# Altium project BTL_IOT.PrjPcb
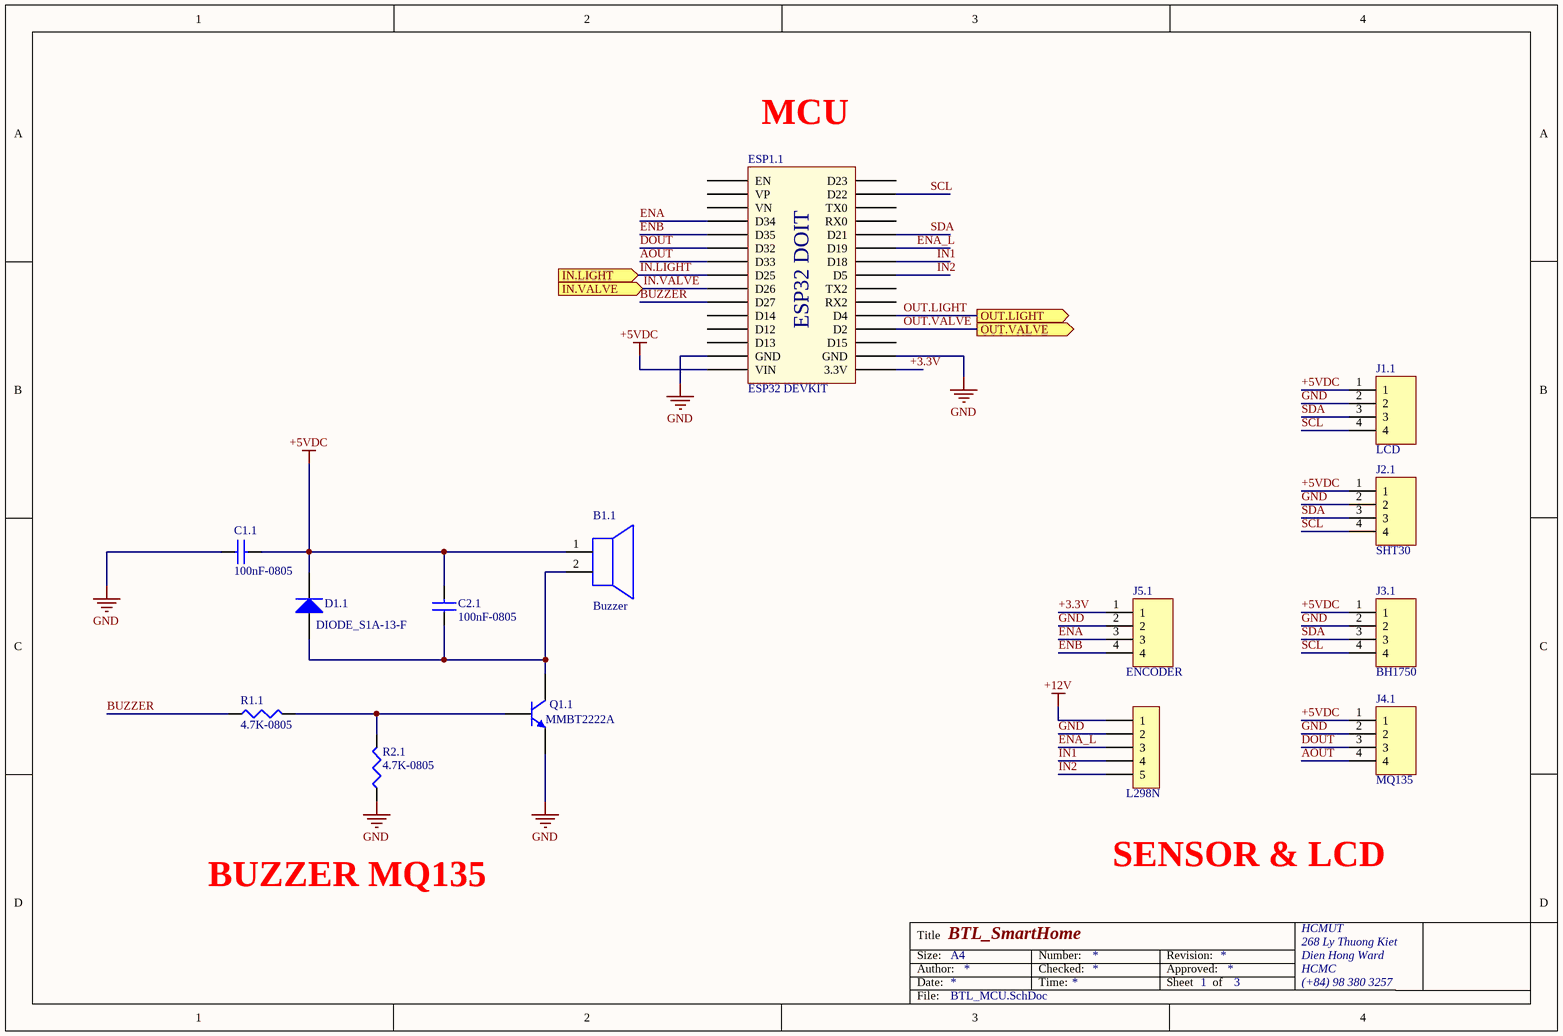
[diagram p0: BTL_MCU.SchDoc]
3 sheets, 54 parts. Net scope: flat (ports and power ports of the same name join across sheets).
Board file: BTL_IOT.PcbDoc
Sheets:
  BTL_MCU.SchDoc
  BTL_POWER.SchDoc
  BTL_RELAY.SchDoc

## Sheet BTL_MCU.SchDoc: BTL_SmartHome
size A4; Organization: HCMUT; Address1: 268 Ly Thuong Kiet; Address2: Dien Hong Ward; Address3: HCMC; Address4: (+84) 98 380 3257; SheetNumber: 1; SheetTotal: 3

### Parts
B1.1  Buzzer  [Buzzer]
C1.1  100nF-0805  [CAP0805]
C2.1  100nF-0805  [CAP0805]
D1.1  DIODE_S1A-13-F  [DO-214AC]
ESP1.1  ESP32 DEVKIT  [ESP32 WROOM 32 KIT]
H1.1  L298N  [XH2.54M-5]
J1.1  LCD  [CON4_78_B4B-PH-K-S(LF)(SN)]
J2.1  SHT30  [CON4_78_B4B-PH-K-S(LF)(SN)]
J3.1  BH1750  [CON4_78_B4B-PH-K-S(LF)(SN)]
J4.1  MQ135  [CON4_78_B4B-PH-K-S(LF)(SN)]
J5.1  ENCODER  [CON4_78_B4B-PH-K-S(LF)(SN)]
Q1.1  MMBT2222A  [SOT23-3]
R1.1  4.7K-0805  [RES0805]
R2.1  4.7K-0805  [RES0805]

### Ports
IN.LIGHT (in), IN.VALVE (in), OUT.LIGHT (out), OUT.VALVE (out)

### Nets
+5VDC: B1.1.1(+) C1.1.2 C2.1.2 D1.1.2(K) ESP1.1.15(VIN) J1.1.1 J2.1.1 J3.1.1 J4.1.1
+12V: H1.1.1
GND: C1.1.1 ESP1.1.14(GND) ESP1.1.17(GND) H1.1.2 J1.1.2 J2.1.2 J3.1.2 J4.1.2 J5.1.2 Q1.1.2(E) R2.1.1
+3.3V: ESP1.1.16(3.3V) J5.1.1
AOUT: ESP1.1.7(D33) J4.1.4
BUZZER: ESP1.1.10(D27) R1.1.1
DOUT: ESP1.1.6(D32) J4.1.3
ENA: ESP1.1.4(D34) J5.1.3
ENA_L: ESP1.1.25(D19) H1.1.3
ENB: ESP1.1.5(D35) J5.1.4
IN1: ESP1.1.24(D18) H1.1.4
IN2: ESP1.1.23(D5) H1.1.5
IN.LIGHT: ESP1.1.8(D25) ; port IN.LIGHT
IN.VALVE: ESP1.1.9(D26) ; port IN.VALVE
OUT.LIGHT: ESP1.1.20(D4) ; port OUT.LIGHT
OUT.VALVE: ESP1.1.19(D2) ; port OUT.VALVE
SCL: ESP1.1.29(D22) J1.1.4 J2.1.4 J3.1.4
SDA: ESP1.1.26(D21) J1.1.3 J2.1.3 J3.1.3
NetB1.1_2: B1.1.2(-) C2.1.1 D1.1.1(A) Q1.1.3(C)
NetQ1.1_1: Q1.1.1(B) R1.1.2 R2.1.2

Not connected (* = marked no-connect by the designer): ESP1.1 1(EN) 2(VP) 3(VN) 11(D14) 12(D12) 13(D13) 18(D15) 21(RX2) 22(TX2) 27(RX0) 28(TX0) 30(D23)

### Notes on the sheet
- (near ESP1.1) MCU
- BUZZER MQ135
- SENSOR & LCD
- Title
- Size:
- Date:
- Author:
- A4
- Number:
- Time:
- Checked:
- Revision:
- Sheet
- Approved:
- of
- File:
- (in symbol ESP32 WROOM 32 KIT) ESP32 DOIT

### Library data of the parts
C1.1 C2.1 = CC0805JRNPO9BN300: CAP CER 30PF 50V NPO 0805; Manufacturer: Yageo; Tolerance: ±5%; Temperature Coefficient: C0G, NP0; Notification: Current market demand for these product types have resulted in fluctuating and extending lead times. Lead times may differ.; Supplier 1: Digi-Key; Manufacturer Part Number: CC0805JRNPO9BN300; RoHS: RoHS Compliant; Category: Capacitors; Stock 1: 0; Pricing 1: 1=0.15, 10=0.107, 100=0.0503, 500=0.03524, 1000=0.02918 (USD); Packaging: Cut Tape (CT); Part Status: Active; Voltage - Rated: 50V; Operating Temperature: -55°C ~ 125°C; Features: High Voltage; Ratings: -; Applications: General Purpose; Failure Rate: -; Mounting Type: Surface Mount, MLCC; Package / Case: 0805 (2012 Metric); Size / Dimension: 0.079" L x 0.049" W (2.00mm x 1.25mm); Height - Seated (Max): -; Thickness (Max): 0.028" (0.70mm); Lead Spacing: -; Lead Style: -; ComponentLink1URL: http://www.yageo.com/documents/recent/UPY-GP_NP0_16V-to-50V_16.pdf; ComponentLink1Description: http://www.yageo.com/documents/recent/UPY-GP_NP0_16V-to-50V_16.pdf; Supplier Part Number 1: 311-4234-1-ND
D1.1 = DIODE_S1A-13-F: DIODE GEN PURP 50V 1A SMA; Manufacturer: Diodes Incorporated; Diode Type: Standard; Speed: Standard Recovery >500ns, > 200mA (Io); Capacitance @ Vr, F: 10pF @ 4V, 1MHz; Supplier 1: Digi-Key; Manufacturer Part Number: S1A-13-F; RoHS: RoHS Compliant; Category: Discrete Semiconductor Products; Stock 1: 293435; Pricing 1: 1=0.27, 10=0.219, 100=0.1163, 500=0.07652, 1000=0.05203 (USD); Packaging: Digi-Reel®; Part Status: Active; Current - Average Rectified (Io): 1A; Mounting Type: Surface Mount; Package / Case: DO-214AC, SMA; Supplier Device Package: SMA; Operating Temperature - Junction: -65°C ~ 150°C; Base Part Number: S1A; ComponentLink1URL: https://www.diodes.com/assets/Datasheets/ds16003.pdf; ComponentLink1Description: https://www.diodes.com/assets/Datasheets/ds16003.pdf; Supplier Part Number 1: S1A-FDIDKR-ND
ESP1.1 = ESP32 WROOM 32 KIT
H1.1 = Header 5P 2.54 Duc Thang: Cắm; Ten_Linh_Kien: Header 5P XH2.54-5P Đực Thẳng; Don_Vi: Con; Ma_Hang: MH001298; Chung_Loai: Cắm
J1.1 J2.1 J3.1 J4.1 J5.1 = CON-PLG_4X1-78-ST-TH: Connector Header Through Hole 4 position 0.079" (2.00mm); Manufacturer Part Number: B4B-PH-K-S(LF)(SN); Manufacturer: JST; Mating Part Number: PHR-4; Crimp Part Number: ASPHSPH24K51; Alternate Part Number-1: NA; Case/Package: TH; Supplier-1: SP Road; Supplier Part Number-1: NA
Q1.1 = MMBT2222A: TRANS NPN 40V 1A SOT-23; Manufacturer: ON Semiconductor; Vce Saturation (Max) @ Ib, Ic: 1V @ 50mA, 500mA; Current - Collector Cutoff (Max): 10nA (ICBO); DC Current Gain (hFE) (Min) @ Ic, Vce: 100 @ 150mA, 10V; Frequency - Transition: 300MHz; Supplier 1: Digi-Key; Manufacturer Part Number: MMBT2222A; RoHS: RoHS Compliant; Category: Discrete Semiconductor Products; Stock 1: 220769; Pricing 1: 1=0.21, 10=0.17, 100=0.09, 500=0.05922, 1000=0.04027 (USD); Packaging: Cut Tape (CT); Part Status: Last Time Buy; Transistor Type: NPN; Operating Temperature: 150°C (TJ); Mounting Type: Surface Mount; Package / Case: TO-236-3, SC-59, SOT-23-3; Supplier Device Package: SOT-23-3; Base Part Number: MMBT2222; ComponentLink1URL: https://www.fairchildsemi.com/datasheets/MM/MMBT2222A.pdf; ComponentLink1Description: https://www.fairchildsemi.com/datasheets/MM/MMBT2222A.pdf; Supplier Part Number 1: MMBT2222AFSCT-ND
R1.1 R2.1 = AC0805JR-070RL: RES SMD 0.0OHM JUMPER 1/8W 0805; Manufacturer 1: Yageo; Category 1: Resistors; Resistance (Ohms): 0.0; Power (Watts): 0.125W, 1/8W; Value: 0R; Supplier 1: Digi-Key; Manufacturer Part Number 1: AC0805JR-070RL; RoHS 1: RoHS Compliant; Description 1: RES SMD 0.0OHM JUMPER 1/8W 0805; Stock 1: 16192; Pricing 1: 1=0.1, 10=0.03, 25=0.022, 50=0.0166, 100=0.0123, 250=0.00936, 500=0.00748, 1000=0.00551 (USD); Packaging: Cut Tape (CT); Part Status: Active; Tolerance: Jumper; Composition: Thick Film; Features: Automotive AEC-Q200, Moisture Resistant; Temperature Coefficient: -; Operating Temperature: -55°C ~ 155°C; Package / Case: 0805 (2012 Metric); Supplier Device Package: 0805; Size / Dimension: 0.079" L x 0.049" W (2.00mm x 1.25mm); Height - Seated (Max): 0.024" (0.60mm); Failure Rate: -; ComponentLink1URL: http://www.yageo.com/NewPortal/yageodocoutput?fileName=/pdf/R-Chip/PYu-AC_51_RoHS_L_5.pdf; ComponentLink1Description: http://www.yageo.com/NewPortal/yageodocoutput?fileName=/pdf/R-Chip/PYu-AC_51_RoHS_L_5.pdf; Supplier Part Number 1: YAG3755CT-ND

## Sheet BTL_POWER.SchDoc: BTL_SmartHome
size A4; Organization: HCMUT; Address1: 268 Ly Thuong Kiet; Address2: Dien Hong Ward; Address3: HCMC; Address4: (+84) 98 380 3257; SheetNumber: 2; SheetTotal: 3
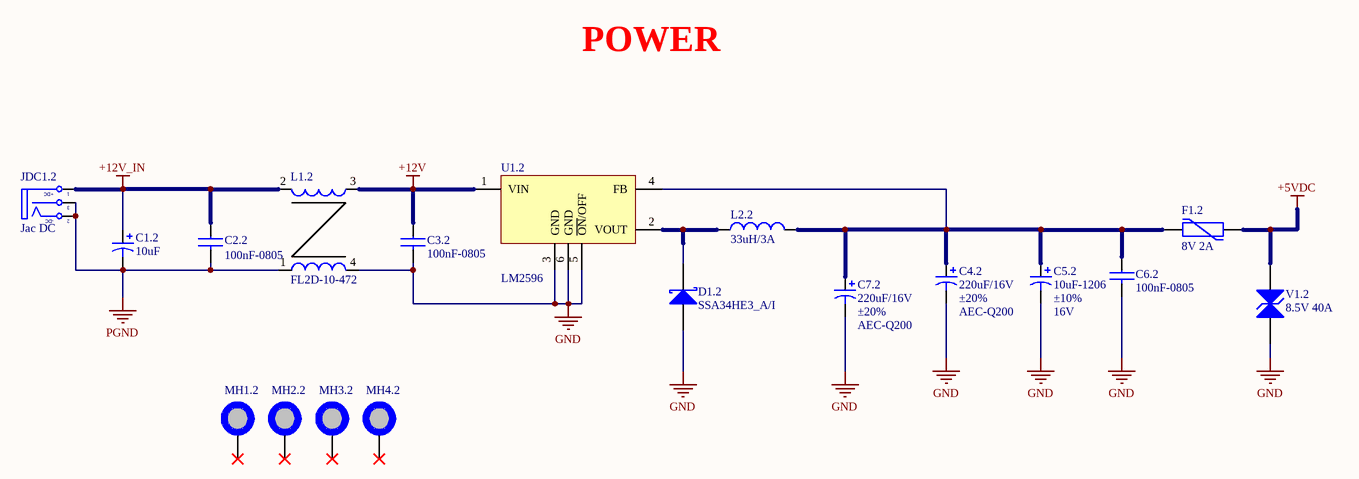
[diagram p1: BTL_POWER.SchDoc]

### Parts
C1.2  10uF  [CAP_ALUMINUM_D8]
C2.2  100nF-0805  [CAP0805]
C3.2  100nF-0805  [CAP0805]
C4.2  220uF/16V  Tolerance: ±20%  Ratings: AEC-Q200  [CAP_ALUMINUM_D8]
C5.2  10uF-1206  Tolerance: ±10%  Voltage - Rated: 16V  [CAP1206_TANTALUM_YELLOW]
C6.2  100nF-0805  [CAP0805]
C7.2  220uF/16V  Tolerance: ±20%  Ratings: AEC-Q200  [CAP_ALUMINUM_D8]
D1.2  SSA34HE3_A/I  [DO-214AC]
F1.2  8V 2A  [FUSE_PTC_SMD1812_03]
JDC1.2  Jac DC  [DC-IN]
L1.2  FL2D-10-472  [INDC_FL2D-10-472]
L2.2  33uH/3A  [INDC_CDRH8D28]
MH1.2  MH_5MMC_3.2MMD  [MH_5MMD_3.2MMD]  (value not drawn)  (no BOM)
MH2.2  MH_5MMC_3.2MMD  [MH_5MMD_3.2MMD]  (value not drawn)  (no BOM)
MH3.2  MH_5MMC_3.2MMD  [MH_5MMD_3.2MMD]  (value not drawn)  (no BOM)
MH4.2  MH_5MMC_3.2MMD  [MH_5MMD_3.2MMD]  (value not drawn)  (no BOM)
U1.2  LM2596  [TO263-5]
V1.2  8.5V 40A  [INDC0805]

### Nets
+5VDC: F1.2.2 V1.2.1
+12V: C3.2.1 L1.2.3 U1.2.1(VIN)
+12V_IN: C1.2.1 C2.2.1 JDC1.2.1(T) L1.2.2
GND: C3.2.2 C4.2.2 C5.2.2 C6.2.2 C7.2.2 D1.2.1(A) L1.2.4 U1.2.3(GND) U1.2.5(~{ON}/OFF) U1.2.6(GND) V1.2.2
PGND: C1.2.2 C2.2.2 JDC1.2.2(TN) JDC1.2.3(S) L1.2.1
NetC4.2_1: C4.2.1 C5.2.1 C6.2.1 C7.2.1 F1.2.1 L2.2.2 U1.2.4(FB)
NetD1.2_2: D1.2.2(K) L2.2.1 U1.2.2(VOUT)

Not connected (* = marked no-connect by the designer): MH1.2 1*; MH2.2 1*; MH3.2 1*; MH4.2 1*

### Notes on the sheet
- POWER
- Title
- Size:
- Date:
- Author:
- A4
- Number:
- Time:
- Checked:
- Revision:
- Sheet
- Approved:
- of
- File:
- (in symbol DCIN) +DC; -DC

### Library data of the parts
C1.2 C4.2 C7.2 = EEE-FK1C470P: CAP ALUM 47UF 20% 16V SMD; Manufacturer: Panasonic Electronic Components; Lifetime @ Temp.: 2000 Hrs @ 105°C; Polarization: Polar; Surface Mount Land Size: 0.260" L x 0.260" W (6.60mm x 6.60mm); Supplier 1: Digi-Key; Manufacturer Part Number: EEE-FK1C470P; RoHS: RoHS Compliant; Category: Capacitors; Stock 1: 97208; Pricing 1: 1=0.51, 10=0.354, 100=0.2123, 500=0.1592 (USD); Packaging: Digi-Reel®; Part Status: Active; ESR (Equivalent Series Resistance): -; Operating Temperature: -55°C ~ 105°C; Applications: Automotive; Lead Spacing: -; Size / Dimension: 0.248" Dia (6.30mm); Height - Seated (Max): 0.240" (6.10mm); Mounting Type: Surface Mount; Package / Case: Radial, Can - SMD; ComponentLink1URL: http://industrial.panasonic.com/www-cgi/jvcr13pz.cgi?E+PZ+3+ABA0120+EEEFK1C470P+7+WW; ComponentLink1Description: http://industrial.panasonic.com/www-cgi/jvcr13pz.cgi?E+PZ+3+ABA0120+EEEFK1C470P+7+WW; Supplier Part Number 1: PCE3790DKR-ND; Value: 47uF
C2.2 C3.2 C6.2 = CC0805JRNPO9BN300: as C1.1 on sheet BTL_MCU; Supplier 1: Digi-Key; Manufacturer Part Number: CC0805JRNPO9BN300; RoHS: RoHS Compliant; Category: Capacitors; Stock 1: 0; Pricing 1: 1=0.15, 10=0.107, 100=0.0503, 500=0.03524, 1000=0.02918 (USD); Packaging: Cut Tape (CT); Part Status: Active; Voltage - Rated: 50V; Operating Temperature: -55°C ~ 125°C; Features: High Voltage; Ratings: -; Applications: General Purpose; Failure Rate: -; Mounting Type: Surface Mount, MLCC; Package / Case: 0805 (2012 Metric); Size / Dimension: 0.079" L x 0.049" W (2.00mm x 1.25mm); Height - Seated (Max): -; Thickness (Max): 0.028" (0.70mm); Lead Spacing: -; Lead Style: -; ComponentLink1URL: http://www.yageo.com/documents/recent/UPY-GP_NP0_16V-to-50V_16.pdf; ComponentLink1Description: http://www.yageo.com/documents/recent/UPY-GP_NP0_16V-to-50V_16.pdf; Supplier Part Number 1: 311-4234-1-ND
C5.2 = T491A106K016AT: CAP TANT 10UF 16V 10% 1206; Manufacturer 1: KEMET; Manufacturer Size Code: A; Category 1: Capacitors; Capacitance: 10µF; Type: Molded; ESR (Equivalent Series Resistance): 7 Ohm; Lifetime @ Temp.: 2000 Hrs @ 85°C; Supplier 1: Digi-Key; Supplier Part Number 1: 399-8269-1-ND; Manufacturer Part Number 1: T491A106K016AT; RoHS 1: RoHS Compliant; Description 1: CAP TANT 10UF 16V 10% 1206; Stock 1: 54083; Pricing 1: 1=0.45, 10=0.312, 100=0.1873, 500=0.14048, 1000=0.11862 (USD); Packaging: Cut Tape (CT); Part Status: Active; Operating Temperature: -55°C ~ 125°C; Mounting Type: Surface Mount; Package / Case: 1206 (3216 Metric); Size / Dimension: 0.126" L x 0.063" W (3.20mm x 1.60mm); Height - Seated (Max): 0.071" (1.80mm); Lead Spacing: -; Features: General Purpose; Failure Rate: -; ComponentLink1URL: http://www.kemet.com/Lists/ProductCatalog/Attachments/254/KEM_T2005_T491.pdf; ComponentLink1Description: http://www.kemet.com/Lists/ProductCatalog/Attachments/254/KEM_T2005_T491.pdf; Value: 10uF
D1.2 = DIODE_SSA34HE3_A/I: DIODE SCHOTTKY 40V 3A DO214AC; Manufacturer 1: Vishay Semiconductor Diodes Division; Category 1: Discrete Semiconductor Products; Voltage - Forward (Vf) (Max) @ If: 490mV @ 3A; Speed: Fast Recovery =< 500ns, > 200mA (Io); Current - Reverse Leakage @ Vr: 200µA @ 40V; Supplier 1: Digi-Key; Supplier Part Number 1: SSA34HE3_A/I-ND; Manufacturer Part Number 1: SSA34HE3_A/I; RoHS 1: RoHS Compliant; Description 1: DIODE SCHOTTKY 40V 3A DO214AC; Stock 1: 0; Pricing 1: 7500=0.13508 (USD); Packaging: Tape & Reel (TR); Part Status: Active; Diode Type: Schottky; Voltage - DC Reverse (Vr) (Max): 40V; Current - Average Rectified (Io): 3A; Capacitance @ Vr, F: -; Mounting Type: Surface Mount; Package / Case: DO-214AC, SMA; Supplier Device Package: DO-214AC (SMA); Operating Temperature - Junction: -65°C ~ 150°C; ComponentLink1URL: http://www.vishay.com/docs/88883/ssa33l.pdf; ComponentLink1Description: http://www.vishay.com/docs/88883/ssa33l.pdf
F1.2 = FUSE_MF-MSMF200-2: PTC RESET FUSE 8V 2A 1812; Manufacturer: Bourns; Number of Terminals/Pins: 2; Max Current Rating: 40A; Power Dissipation: 800mW; Trip Current: 4A; Resistance: 80mR; Time to Trip: 3s; Aging: 1000 hr @ +85 °C (Passive); Approvals: UL,CSA,TUV; Supplier 1: Digi-Key; Supplier Part Number 1: MF-MSMF200-2CT-ND; Manufacturer Part Number: MF-MSMF200-2; RoHS: Yes; Category: Fuses; Stock 1: 15085; Pricing 1: 1=0.67000, 5=0.65000, 10=0.63000, 50=0.53000, 100=0.44000, 250=0.40000, 500=0.33998, 1000=0.29998 (USD); Mount: PCB,Surface Mount; Case/Package: 1812; Number of Pins: 2; Case Code (Metric): 4532; Case Code (Imperial): 1812; Terminal Material: Gold; Min Operating Temperature: -40°C; Max Operating Temperature: 85°C; Hold Current: 2A; Current Rating: 40A; Package Quantity: 2000; Packaging: Tape and Reel; Operating Supply Voltage: 8V; Voltage Rating: 8V; Termination: SMD/SMT; Max Power Dissipation: 800mW; Voltage Rating (DC): 8V; Series: MF-MSMF; Length: 4.73mm; Width: 3.41mm; Height: 0.85mm; Radiation Hardening: No; REACH SVHC: No SVHC; Lead Free: Lead Free; RoHS Compliant: Yes; ComponentLink1URL: https://datasheet.ciiva.com/326/mfmsmf-326966.pdf?src-supplier=Digi-Key; ComponentLink1Description: https://datasheet.ciiva.com/326/mfmsmf-326966.pdf?src-supplier=Digi-Key; ComponentLink2URL: https://datasheet.ciiva.com/326/mfmsmf-326967.pdf?src-supplier=Digi-Key; ComponentLink2Description: https://datasheet.ciiva.com/326/mfmsmf-326967.pdf?src-supplier=Digi-Key; ComponentLink3URL: https://datasheet.ciiva.com/1274/1786007-1274556.pdf?src-supplier=Element14; ComponentLink3Description: https://datasheet.ciiva.com/1274/1786007-1274556.pdf?src-supplier=Element14; ComponentLink4URL: https://datasheet.ciiva.com/1228/1786007-1228163.pdf?src-supplier=Newark; ComponentLink4Description: https://datasheet.ciiva.com/1228/1786007-1228163.pdf?src-supplier=Newark; ComponentLink5URL: https://datasheet.ciiva.com/3020/mfmsmf-3020419.pdf?src-supplier=Avnet; ComponentLink5Description: https://datasheet.ciiva.com/3020/mfmsmf-3020419.pdf?src-supplier=Avnet; ComponentLink6URL: https://datasheet.ciiva.com/326/mfmsmf-326968.pdf?src-supplier=Digi-Key; ComponentLink6Description: https://datasheet.ciiva.com/326/mfmsmf-326968.pdf?src-supplier=Digi-Key; ComponentLink7URL: https://datasheet.ciiva.com/16692/mfmsmf-16692201.pdf?src-supplier=Avnet+Europe; ComponentLink7Description: https://datasheet.ciiva.com/16692/mfmsmf-16692201.pdf?src-supplier=Avnet+Europe; ComponentLink8URL: https://datasheet.ciiva.com/3019/mfmsmf-3019786.pdf?src-supplier=Avnet; ComponentLink8Description: https://datasheet.ciiva.com/3019/mfmsmf-3019786.pdf?src-supplier=Avnet; ComponentLink9URL: https://datasheet.ciiva.com/28411/1786007-28411578.pdf?src-supplier=Element14; ComponentLink9Description: https://datasheet.ciiva.com/28411/1786007-28411578.pdf?src-supplier=Element14; ComponentLink10URL: https://datasheet.ciiva.com/15187/getdatasheetpartid-117210-15187148.pdf?src-supplier=Verical; ComponentLink10Description: https://datasheet.ciiva.com/15187/getdatasheetpartid-117210-15187148.pdf?src-supplier=Verical; ComponentLink11URL: https://datasheet.ciiva.com/1274/1786007-1274557.pdf?src-supplier=Element14; ComponentLink11Description: https://datasheet.ciiva.com/1274/1786007-1274557.pdf?src-supplier=Element14; ComponentLink12URL: https://datasheet.ciiva.com/30196/575mfmsmf-30196429.pdf?src-supplier=Onlinecomponents.com; ComponentLink12Description: https://datasheet.ciiva.com/30196/575mfmsmf-30196429.pdf?src-supplier=Onlinecomponents.com
JDC1.2 = DCIN: Jac DC input; Value: Jac DC
L1.2 = IND_FL2D-10-472: 4.7uH, 1A
L2.2 = IND_CDRH8D28NP-100NC: FIXED IND 10UH 3.2A 47 MOHM SMD; Manufacturer: Sumida America Components Inc.; Material - Core: Ferrite; Tolerance: ±30%; Shielding: Shielded; DC Resistance (DCR): 47 mOhm Max; Supplier 1: Digi-Key; Manufacturer Part Number: CDRH8D28NP-100NC; RoHS: RoHS Compliant; Category: Inductors, Coils, Chokes; Stock 1: 16843; Pricing 1: 1=1.13, 10=1.047, 100=0.7567, 500=0.5796 (USD); Packaging: Cut Tape (CT); Part Status: Active; Type: -; Q @ Freq: -; Ratings: -; Operating Temperature: -40°C ~ 100°C; Mounting Type: Surface Mount; Package / Case: Nonstandard; Supplier Device Package: -; Size / Dimension: 0.315" L x 0.315" W (8.00mm x 8.00mm); Height - Seated (Max): 0.118" (3.00mm); ComponentLink1URL: http://products.sumida.com/products/pdf/CDRH8D28.pdf; ComponentLink1Description: http://products.sumida.com/products/pdf/CDRH8D28.pdf; Supplier Part Number 1: 308-1658-1-ND; Value: 10uH
MH1.2 MH2.2 MH3.2 MH4.2 = MH_5MMC_3.2MMD: Mounting Hole 5mm Diameter, 3.2mm Drill
U1.2 = LM2596: 1A Regulator
V1.2 = VARISTOR_VC080505A150RP: VARISTOR 8.5V 40A 0805; Manufacturer: Kyocera AVX; Number of Terminals/Pins: 2; Capacitance: 1.1nF; Max Voltage Rating (AC): 4V; Max Voltage Rating (DC): 5.6V; Clamping Current: 1A; Clamping Voltage: 18V; Number of Circuits: 1; Energy: 0.1J; ESD Protection: Yes; Voltage Tolerance: 20%; Min Varistor Voltage: 6.8V; Max Varistor Voltage: 10.2V; Current Rating: 1mA; Supplier 1: Digi-Key; Supplier Part Number 1: 478-11137-2-ND; Manufacturer Part Number: VC080505A150RP; RoHS: Yes; Category: Varistors; Pricing 1: 4000=0.11550, 8000=0.10850, 12000=0.10150, 28000=0.09310 (USD); Mount: Surface Mount; Case/Package: 0805; Case Code (Imperial): 0805; Case Code (Metric): 2012; Material: Ceramic; Contact Plating: Tin,Matte; Min Operating Temperature: -55°C; Max Operating Temperature: 125°C; Varistor Voltage: 8.5V; Max Surge Current: 40A; Voltage Rating: 5.6V; Voltage Rating (AC): 4V; Voltage Rating (DC): 5.6V; Packaging: Tape and Reel; Max Output Current: 40A; Package Quantity: 4000; Termination: SMD/SMT; Operating Supply Voltage: 5.6V; Length: 2.01mm; Width: 1.25mm; Depth: 1.25mm; REACH SVHC: No SVHC; Lead Free: Lead Free; RoHS Compliant: Yes; ComponentLink1URL: https://datasheet.ciiva.com/34302/1155151-34302026.pdf?src-supplier=Jameco; ComponentLink1Description: https://datasheet.ciiva.com/34302/1155151-34302026.pdf?src-supplier=Jameco; ComponentLink2URL: https://datasheet.ciiva.com/3024/tguard-3024149.pdf?src-supplier=Avnet; ComponentLink2Description: https://datasheet.ciiva.com/3024/tguard-3024149.pdf?src-supplier=Avnet; ComponentLink3URL: https://datasheet.ciiva.com/7971/tguard-7971624.pdf?src-supplier=Element14; ComponentLink3Description: https://datasheet.ciiva.com/7971/tguard-7971624.pdf?src-supplier=Element14; ComponentLink4URL: https://datasheet.ciiva.com/369/tguard-369629.pdf?src-supplier=Digi-Key; ComponentLink4Description: https://datasheet.ciiva.com/369/tguard-369629.pdf?src-supplier=Digi-Key

## Sheet BTL_RELAY.SchDoc: BTL_SmartHome
size A4; Organization: HCMUT; Address1: 268 Ly Thuong Kiet; Address2: Dien Hong Ward; Address3: HCMC; Address4: (+84) 98 380 3257; SheetNumber: 3; SheetTotal: 3
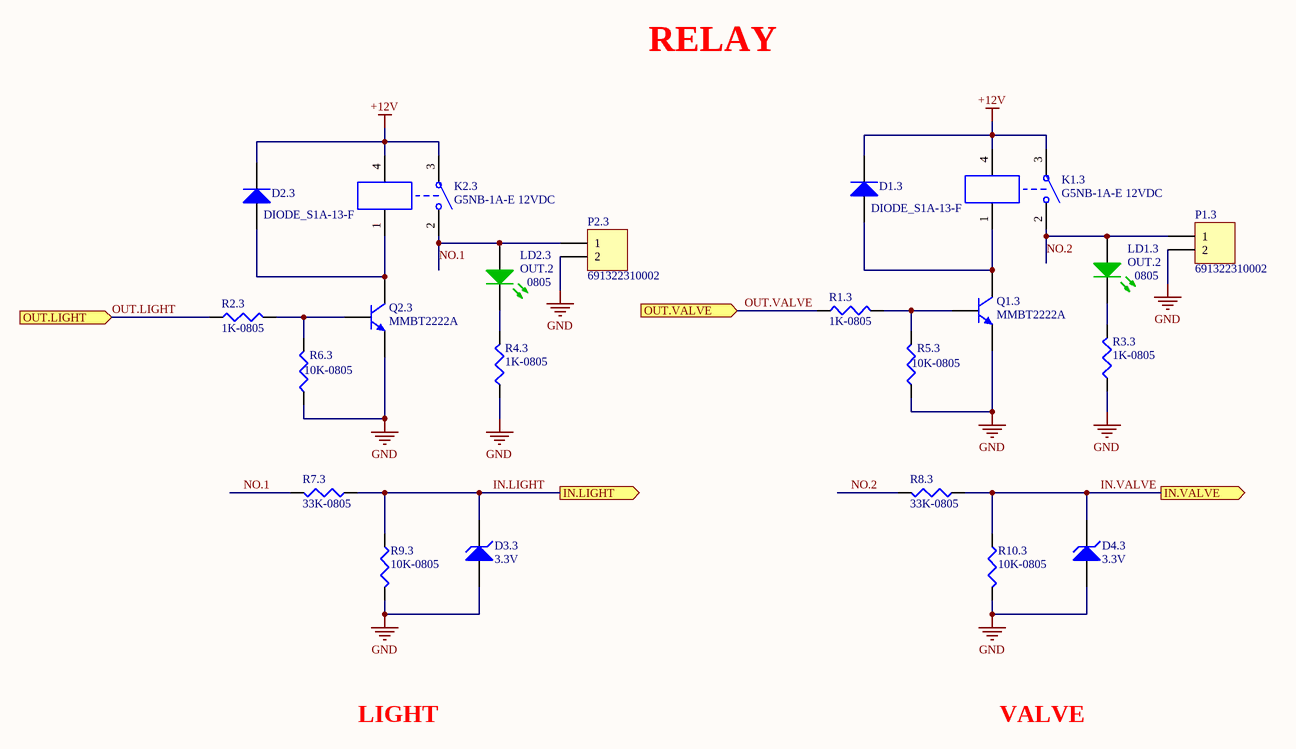
[diagram p2: BTL_RELAY.SchDoc]

### Parts
D1.3  DIODE_S1A-13-F  [DO-214AC]
D2.3  DIODE_S1A-13-F  [DO-214AC]
D3.3  3.3V  [SOD123]
D4.3  3.3V  [SOD123]
K1.3  G5NB-1A-E 12VDC  [RELAY-G5NB-1A-E 24VDC]
K2.3  G5NB-1A-E 12VDC  [RELAY-G5NB-1A-E 24VDC]
LD1.3  OUT.2  Package / Case: 0805  [LED_SMD0805_GREEN]
LD2.3  OUT.2  Package / Case: 0805  [LED_SMD0805_GREEN]
P1.3  691322310002  [TERMINAL_KF2EDGR_F_1X2_3.81]
P2.3  691322310002  [TERMINAL_KF2EDGR_F_1X2_3.81]
Q1.3  MMBT2222A  [SOT23-3]
Q2.3  MMBT2222A  [SOT23-3]
R1.3  1K-0805  [RES0805]
R2.3  1K-0805  [RES0805]
R3.3  1K-0805  [RES0805]
R4.3  1K-0805  [RES0805]
R5.3  10K-0805  [RES0805]
R6.3  10K-0805  [RES0805]
R7.3  33K-0805  [RES0805]
R8.3  33K-0805  [RES0805]
R9.3  10K-0805  [RES0805]
R10.3  10K-0805  [RES0805]

### Ports
IN.LIGHT (out), IN.VALVE (out), OUT.LIGHT (in), OUT.VALVE (in)

### Nets
+12V: D1.3.2(K) D2.3.2(K) K1.3.3(NO) K1.3.4 K2.3.3(NO) K2.3.4
GND: D3.3.1(A) D4.3.1(A) P1.3.2 P2.3.2 Q1.3.2(E) Q2.3.2(E) R3.3.1 R4.3.1 R5.3.1 R6.3.1 R9.3.2 R10.3.2
IN.LIGHT: D3.3.2(K) R7.3.1 R9.3.1 ; port IN.LIGHT
IN.VALVE: D4.3.2(K) R8.3.1 R10.3.1 ; port IN.VALVE
NO.1: K2.3.2(NC) LD2.3.1(A) P2.3.1 R7.3.2
NO.2: K1.3.2(NC) LD1.3.1(A) P1.3.1 R8.3.2
OUT.LIGHT: R2.3.1 ; port OUT.LIGHT
OUT.VALVE: R1.3.1 ; port OUT.VALVE
NetD1.3_1: D1.3.1(A) K1.3.1(COM) Q1.3.3(C)
NetD2.3_1: D2.3.1(A) K2.3.1(COM) Q2.3.3(C)
NetLD1.3_2: LD1.3.2(K) R3.3.2
NetLD2.3_2: LD2.3.2(K) R4.3.2
NetQ1.3_1: Q1.3.1(B) R1.3.2 R5.3.2
NetQ2.3_1: Q2.3.1(B) R2.3.2 R6.3.2

### Notes on the sheet
- RELAY
- LIGHT
- VALVE
- Title
- Size:
- Date:
- Author:
- A4
- Number:
- Time:
- Checked:
- Revision:
- Sheet
- Approved:
- of
- File:

### Library data of the parts
D1.3 D2.3 = DIODE_S1A-13-F: as D1.1 on sheet BTL_MCU; Supplier 1: Digi-Key; Manufacturer Part Number: S1A-13-F; RoHS: RoHS Compliant; Category: Discrete Semiconductor Products; Stock 1: 293435; Pricing 1: 1=0.27, 10=0.219, 100=0.1163, 500=0.07652, 1000=0.05203 (USD); Packaging: Digi-Reel®; Part Status: Active; Current - Average Rectified (Io): 1A; Mounting Type: Surface Mount; Package / Case: DO-214AC, SMA; Supplier Device Package: SMA; Operating Temperature - Junction: -65°C ~ 150°C; Base Part Number: S1A; ComponentLink1URL: https://www.diodes.com/assets/Datasheets/ds16003.pdf; ComponentLink1Description: https://www.diodes.com/assets/Datasheets/ds16003.pdf; Supplier Part Number 1: S1A-FDIDKR-ND
D3.3 D4.3 = D Zener: Zener Diode; Published: 8-Jun-2000; LatestRevisionDate: 17-Jul-2002; LatestRevisionNote: Re-released for DXP Platform.; PackageReference: DIODE-0.7; Publisher: Altium Limited
K1.3 K2.3 = Relay-G5NB-1A-E 24VDC: Relay 24VDC SPST-NO General Purpose / Industrial; Published: 24-Mar-1999; LatestRevisionDate: 17-Jul-2002; LatestRevisionNote: Re-released for DXP Platform.; PackageReference: DIP-P8; Publisher: Altium Limited
LD1.3 LD2.3 = LED_LTST-C171KGKT: LED GREEN CLEAR 0805 SMD; Manufacturer: Lite-On Inc.; Lens Color: Colorless; Millicandela Rating: 35mcd; Lens Style/Size: Rectangle with Flat Top, 1.40mm x 1.25mm; Voltage - Forward (Vf) (Typ): 2V; Current - Test: 20mA; Viewing Angle: 130°; Wavelength - Dominant: 571nm; Wavelength - Peak: 574nm; Supplier 1: Digi-Key; Manufacturer Part Number: LTST-C171KGKT; RoHS: RoHS Compliant; Category: Optoelectronics; Stock 1: 329702; Pricing 1: 1=0.35, 10=0.255, 25=0.188, 100=0.1344, 250=0.09136, 500=0.08062, 1000=0.06314 (USD); Packaging: Cut Tape (CT); Part Status: Active; Color: Green; Lens Transparency: Clear; Mounting Type: Surface Mount; Features: -; Size / Dimension: 2.00mm L x 1.25mm W; Height (Max): 0.90mm; ComponentLink1URL: http://optoelectronics.liteon.com/upload/download/DS22-2000-118/LTST-C171KGKT.pdf; ComponentLink1Description: http://optoelectronics.liteon.com/upload/download/DS22-2000-118/LTST-C171KGKT.pdf; Supplier Part Number 1: 160-1426-1-ND
P1.3 P2.3 = TERMINAL_KF2EDGR_F_1X2_3.81: TERM BLOCK HDR 2POS 90DEG 3.81MM; Manufacturer: Wurth Electronics Inc.; Number of Positions: 2; Number of Levels: 1; Pitch: 0.150" (3.81mm); Header Orientation: 90°, Right Angle; Material Flammability Rating: UL94 V-0; Contact Tail Length: 0.138" (3.50mm); Supplier 1: Digi-Key; Manufacturer Part Number: 691322310002; RoHS: RoHS Compliant; Category: Connectors, Interconnects; Stock 1: 1180; Pricing 1: 1=0.33, 10=0.296, 50=0.255, 100=0.2375 (USD); Packaging: Bulk; Part Status: Active; Type: Header, Male Pins, Shrouded (4 Side); Positions Per Level: 2; Plug Wire Entry: -; Termination Style: Solder; Mounting Type: Through Hole; Current - IEC: -; Wire Gauge or Range - AWG: -; Wire Gauge or Range - mm²: -; Color: Green; Operating Temperature: -40°C ~ 105°C; Contact Mating Finish: Tin; Features: -; Ingress Protection: -; Screw Size: -; Torque - Screw: -; Wire Strip Length: -; Contact Material: Brass; Housing Material: Polyamide (PA66), Nylon 6/6; Insulation Height: 0.276" (7.00mm); ComponentLink1URL: http://katalog.we-online.de/em/datasheet/6913223100xx.pdf; ComponentLink1Description: http://katalog.we-online.de/em/datasheet/6913223100xx.pdf; Supplier Part Number 1: 732-2088-ND
Q1.3 Q2.3 = MMBT2222A: as Q1.1 on sheet BTL_MCU; Supplier 1: Digi-Key; Manufacturer Part Number: MMBT2222A; RoHS: RoHS Compliant; Category: Discrete Semiconductor Products; Stock 1: 220769; Pricing 1: 1=0.21, 10=0.17, 100=0.09, 500=0.05922, 1000=0.04027 (USD); Packaging: Cut Tape (CT); Part Status: Last Time Buy; Transistor Type: NPN; Operating Temperature: 150°C (TJ); Mounting Type: Surface Mount; Package / Case: TO-236-3, SC-59, SOT-23-3; Supplier Device Package: SOT-23-3; Base Part Number: MMBT2222; ComponentLink1URL: https://www.fairchildsemi.com/datasheets/MM/MMBT2222A.pdf; ComponentLink1Description: https://www.fairchildsemi.com/datasheets/MM/MMBT2222A.pdf; Supplier Part Number 1: MMBT2222AFSCT-ND
R1.3 R2.3 R3.3 R4.3 R5.3 R6.3 R7.3 R8.3 R9.3 R10.3 = AC0805JR-070RL: as R1.1 on sheet BTL_MCU; Supplier 1: Digi-Key; Manufacturer Part Number 1: AC0805JR-070RL; RoHS 1: RoHS Compliant; Description 1: RES SMD 0.0OHM JUMPER 1/8W 0805; Stock 1: 16192; Pricing 1: 1=0.1, 10=0.03, 25=0.022, 50=0.0166, 100=0.0123, 250=0.00936, 500=0.00748, 1000=0.00551 (USD); Packaging: Cut Tape (CT); Part Status: Active; Tolerance: Jumper; Composition: Thick Film; Features: Automotive AEC-Q200, Moisture Resistant; Temperature Coefficient: -; Operating Temperature: -55°C ~ 155°C; Package / Case: 0805 (2012 Metric); Supplier Device Package: 0805; Size / Dimension: 0.079" L x 0.049" W (2.00mm x 1.25mm); Height - Seated (Max): 0.024" (0.60mm); Failure Rate: -; ComponentLink1URL: http://www.yageo.com/NewPortal/yageodocoutput?fileName=/pdf/R-Chip/PYu-AC_51_RoHS_L_5.pdf; ComponentLink1Description: http://www.yageo.com/NewPortal/yageodocoutput?fileName=/pdf/R-Chip/PYu-AC_51_RoHS_L_5.pdf; Supplier Part Number 1: YAG3755CT-ND

## Nets that join several sheets
+5VDC: BTL_MCU (9 pins), BTL_POWER (F1.2.2 V1.2.1)
+12V: BTL_MCU (H1.1.1), BTL_POWER (C3.2.1 L1.2.3 U1.2.1), BTL_RELAY (6 pins)
GND: BTL_MCU (11 pins), BTL_POWER (11 pins), BTL_RELAY (12 pins)
IN.LIGHT: BTL_MCU (ESP1.1.8), BTL_RELAY (D3.3.2 R7.3.1 R9.3.1)
IN.VALVE: BTL_MCU (ESP1.1.9), BTL_RELAY (D4.3.2 R8.3.1 R10.3.1)
OUT.LIGHT: BTL_MCU (ESP1.1.20), BTL_RELAY (R2.3.1)
OUT.VALVE: BTL_MCU (ESP1.1.19), BTL_RELAY (R1.3.1)